# Altium schematic sheet HDMI2.0.SchDoc
size A4
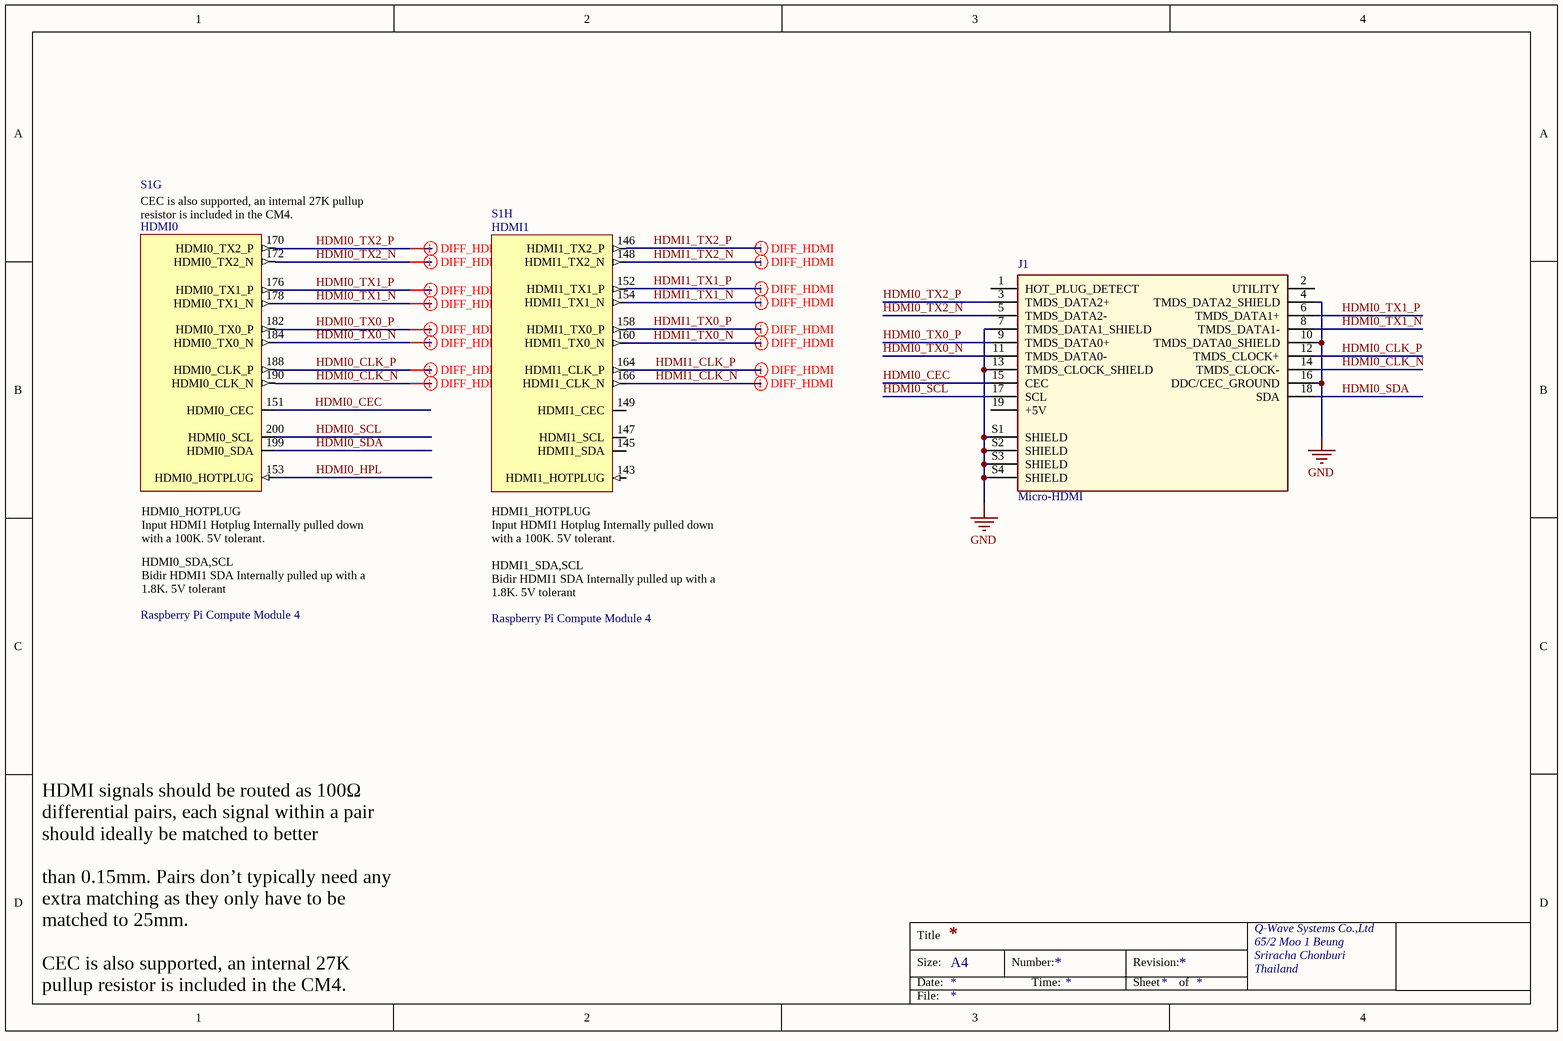
[diagram p0: HDMI2.0.SchDoc]

## Parts
J1  Micro-HDMI  [MICRO HDMI]
S1  Raspberry Pi Compute Module 4  [CM4-F40C-100DS-0.4v_1.5mm_0mm]  (parts G,H of 21)

## Nets
GND: J1.4(TMDS_DATA2_SHIELD) J1.7(TMDS_DATA1_SHIELD) J1.10(TMDS_DATA0_SHIELD) J1.13(TMDS_CLOCK_SHIELD) J1.16(DDC/CEC_GROUND) J1.S1(SHIELD) J1.S2(SHIELD) J1.S3(SHIELD) J1.S4(SHIELD)
HDMI0_CEC: J1.15(CEC) S1.151(HDMI0_CEC)
HDMI0_CLK_N: J1.14(TMDS_CLOCK-) S1.190(HDMI0_CLK_N)
HDMI0_CLK_P: J1.12(TMDS_CLOCK+) S1.188(HDMI0_CLK_P)
HDMI0_HPL: S1.153(HDMI0_HOTPLUG)
HDMI0_SCL: J1.17(SCL) S1.200(HDMI0_SCL)
HDMI0_SDA: J1.18(SDA) S1.199(HDMI0_SDA)
HDMI0_TX0_N: J1.11(TMDS_DATA0-) S1.184(HDMI0_TX0_N)
HDMI0_TX0_P: J1.9(TMDS_DATA0+) S1.182(HDMI0_TX0_P)
HDMI0_TX1_N: J1.8(TMDS_DATA1-) S1.178(HDMI0_TX1_N)
HDMI0_TX1_P: J1.6(TMDS_DATA1+) S1.176(HDMI0_TX1_P)
HDMI0_TX2_N: J1.5(TMDS_DATA2-) S1.172(HDMI0_TX2_N)
HDMI0_TX2_P: J1.3(TMDS_DATA2+) S1.170(HDMI0_TX2_P)
HDMI1_CLK_N: S1.166(HDMI1_CLK_N)
HDMI1_CLK_P: S1.164(HDMI1_CLK_P)
HDMI1_TX0_N: S1.160(HDMI1_TX0_N)
HDMI1_TX0_P: S1.158(HDMI1_TX0_P)
HDMI1_TX1_N: S1.154(HDMI1_TX1_N)
HDMI1_TX1_P: S1.152(HDMI1_TX1_P)
HDMI1_TX2_N: S1.148(HDMI1_TX2_N)
HDMI1_TX2_P: S1.146(HDMI1_TX2_P)

Not connected (* = marked no-connect by the designer): J1 1(HOT_PLUG_DETECT) 2(UTILITY) 19(+5V); S1 143(HDMI1_HOTPLUG) 145(HDMI1_SDA) 147(HDMI1_SCL) 149(HDMI1_CEC)

## Layout directives
differential pair; differential pair class DIFF_100Ohm_HDMI; differential pair class DIFF_HDMI; net class HDMI_18Gbps: HDMI0_CLK_N, HDMI0_CLK_P, HDMI0_TX0_N, HDMI0_TX0_P, HDMI0_TX1_N, HDMI0_TX1_P, HDMI0_TX2_N, HDMI0_TX2_P, HDMI1_CLK_N, HDMI1_CLK_P, HDMI1_TX0_N, HDMI1_TX0_P, HDMI1_TX1_N, HDMI1_TX1_P, HDMI1_TX2_N, HDMI1_TX2_P

## Notes on the sheet
- HDMI signals should be routed as 100Ω differential pairs, each signal within a pair should ideally be matched to better
  than 0.15mm. Pairs don’t typically need any extra matching as they only have to be matched to 25mm.
  CEC is also supported, an internal 27K pullup resistor is included in the CM4.
- Title
- Size:
- Date:
- A4
- Number:
- Time:
- Revision:
- Sheet
- of
- Q-Wave Systems Co.,Ltd
- 65/2 Moo 1 Beung
- Sriracha Chonburi
- Thailand
- File:
- (in symbol CM4, part G) HDMI0; CEC is also supported, an internal 27K pullup resistor is included in the CM4.; HDMI0_HOTPLUG / Input HDMI1 Hotplug Internally pulled down with a 100K. 5V tolerant.; HDMI0_SDA,SCL / Bidir HDMI1 SDA Internally pulled up with a 1.8K. 5V tolerant
- (in symbol CM4, part H) HDMI1; HDMI1_HOTPLUG / Input HDMI1 Hotplug Internally pulled down with a 100K. 5V tolerant.; HDMI1_SDA,SCL / Bidir HDMI1 SDA Internally pulled up with a 1.8K. 5V tolerant

## Library data of the parts
J1 = Micro-HDMI: Conn Micro HDMI RCP 19 POS 0.4mm Solder RA SMD 19 Terminal 1 Port Micro HDMI Embossed T/R; MF: Molex; MP: 0467650301; Package: None; Availability: Unavailable; SnapEDA_Link: https://www.snapeda.com/parts/0467650301/Molex/view-part/?ref=snap; Price: None; Value: *
S1 = CM4: Raspberry Pi Compute Module 4 by Amornthep Phunsin